# Altium schematic sheet MCU_ESP32.SchDoc
size A; SheetNumber: 3; SheetTotal: 10
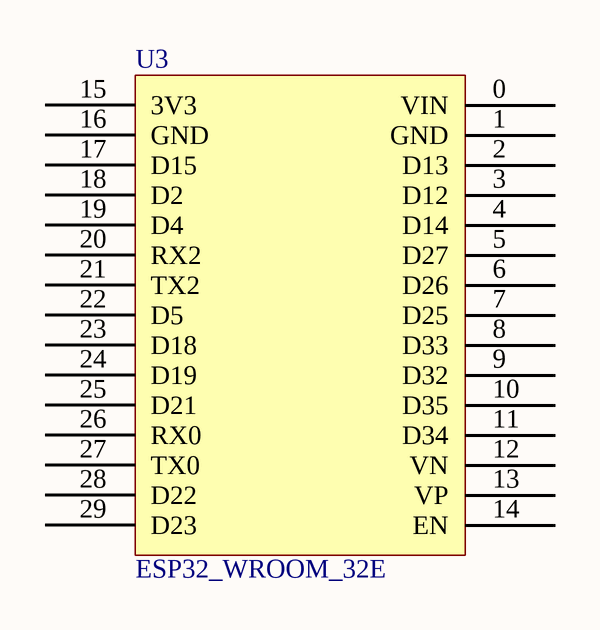
[diagram p0: MCU_ESP32.SchDoc]

## Parts
U3  ESP32_WROOM_32E  [ESP32_WROOM_32E]

## Nets

Not connected (* = marked no-connect by the designer): U3 0(VIN) 1(GND) 2(D13) 3(D12) 4(D14) 5(D27) 6(D26) 7(D25) 8(D33) 9(D32) 10(D35) 11(D34) 12(VN) 13(VP) 14(EN) 15(3V3) 16(GND) 17(D15) 18(D2) 19(D4) 20(RX2) 21(TX2) 22(D5) 23(D18) 24(D19) 25(D21) 26(RX0) 27(TX0) 28(D22) 29(D23)